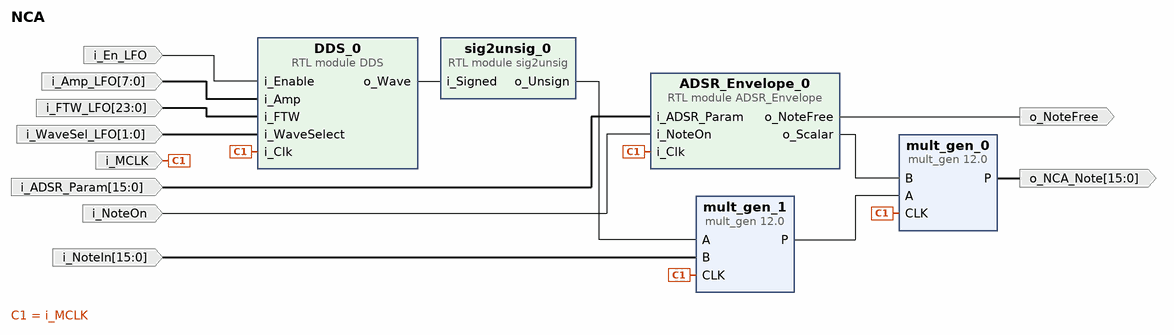
[diagram p0: block diagram of the top level]
# Vivado block design NCA, xc7z020clg400-1, Vivado 2020.2
create_bd_design NCA

create_bd_port -dir I -from 15 -to 0 -type data i_NoteIn
create_bd_port -dir O -from 15 -to 0 -type data o_NCA_Note
create_bd_port -dir I -type clk i_MCLK
set_property -dict {CONFIG.FREQ_HZ 12288000} [get_bd_ports i_MCLK]
create_bd_port -dir I i_En_LFO
create_bd_port -dir I -from 7 -to 0 i_Amp_LFO
create_bd_port -dir I -from 23 -to 0 i_FTW_LFO
create_bd_port -dir I -from 1 -to 0 i_WaveSel_LFO
create_bd_port -dir I -from 15 -to 0 i_ADSR_Param
create_bd_port -dir I i_NoteOn
create_bd_port -dir O o_NoteFree

create_bd_cell -type module -reference sig2unsig sig2unsig_0
create_bd_cell -type module -reference ADSR_Envelope ADSR_Envelope_0
create_bd_cell -type ip -vlnv xilinx.com:ip:mult_gen:12.0 mult_gen_0
set_property -dict [list \
  CONFIG.Multiplier_Construction Use_Mults \
  CONFIG.OptGoal Speed \
  CONFIG.OutputWidthHigh 31 \
  CONFIG.OutputWidthLow 16 \
  CONFIG.PipeStages 3 \
  CONFIG.PortAType Signed \
  CONFIG.PortAWidth 16 \
  CONFIG.PortBType Unsigned \
  CONFIG.PortBWidth 16 \
  CONFIG.Use_Custom_Output_Width true \
] [get_bd_cells mult_gen_0]
create_bd_cell -type ip -vlnv xilinx.com:ip:mult_gen:12.0 mult_gen_1
set_property -dict [list \
  CONFIG.Multiplier_Construction Use_Mults \
  CONFIG.OutputWidthHigh 31 \
  CONFIG.OutputWidthLow 16 \
  CONFIG.PipeStages 3 \
  CONFIG.PortAType Unsigned \
  CONFIG.PortAWidth 16 \
  CONFIG.PortBType Signed \
  CONFIG.PortBWidth 16 \
  CONFIG.Use_Custom_Output_Width true \
] [get_bd_cells mult_gen_1]
create_bd_cell -type module -reference DDS DDS_0

# ---- connections ----

connect_bd_net [get_bd_pins sig2unsig_0/o_Unsign] [get_bd_pins mult_gen_1/A]
connect_bd_net -net B_0_1 [get_bd_ports i_NoteIn] [get_bd_pins mult_gen_1/B]
connect_bd_net [get_bd_pins mult_gen_1/P] [get_bd_pins mult_gen_0/A]
connect_bd_net [get_bd_pins ADSR_Envelope_0/o_Scalar] [get_bd_pins mult_gen_0/B]
connect_bd_net [get_bd_pins mult_gen_0/P] [get_bd_ports o_NCA_Note]
connect_bd_net -net i_Clk_0_1 [get_bd_ports i_MCLK] \
  [get_bd_pins ADSR_Envelope_0/i_Clk] [get_bd_pins mult_gen_1/CLK] [get_bd_pins mult_gen_0/CLK] [get_bd_pins DDS_0/i_Clk]
connect_bd_net [get_bd_pins DDS_0/o_Wave] [get_bd_pins sig2unsig_0/i_Signed]
connect_bd_net [get_bd_ports i_En_LFO] [get_bd_pins DDS_0/i_Enable]
connect_bd_net -net i_Amp_0_1 [get_bd_ports i_Amp_LFO] [get_bd_pins DDS_0/i_Amp]
connect_bd_net -net i_FTW_0_1 [get_bd_ports i_FTW_LFO] [get_bd_pins DDS_0/i_FTW]
connect_bd_net -net i_WaveSelect_0_1 [get_bd_ports i_WaveSel_LFO] [get_bd_pins DDS_0/i_WaveSelect]
connect_bd_net -net i_ADSR_Param_0_1 [get_bd_ports i_ADSR_Param] [get_bd_pins ADSR_Envelope_0/i_ADSR_Param]
connect_bd_net -net i_NoteOn_0_1 [get_bd_ports i_NoteOn] [get_bd_pins ADSR_Envelope_0/i_NoteOn]
connect_bd_net [get_bd_pins ADSR_Envelope_0/o_NoteFree] [get_bd_ports o_NoteFree]

validate_bd_design
save_bd_design
